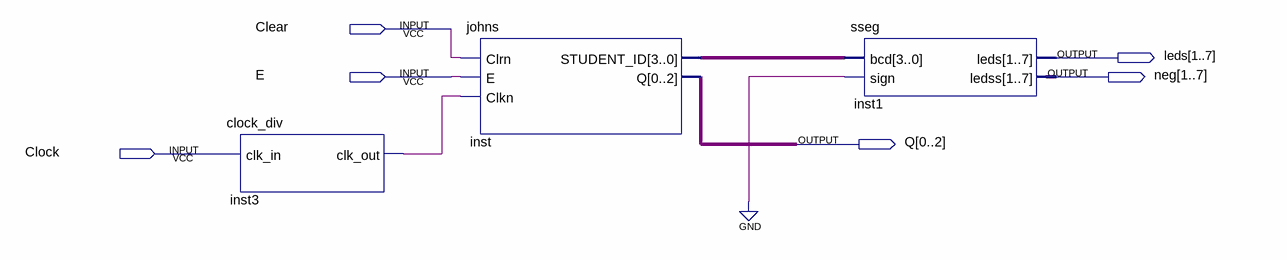
[diagram p0: schematic sheet]
// Quartus schematic JohnsBlock.bdf as structural Verilog: 3 symbols, 6 pins
module JohnsBlock (
  input  Clear,
  input  E,
  input  Clock,
  output [1:7] leds,
  output [1:7] neg,
  output [0:2] Q
);

  wire inst3_clk_out;
  wire [3:0] inst_student_id;

  clock_div inst3 (.clk_in(Clock), .clk_out(inst3_clk_out));
  johns inst (.Clrn(Clear), .E(E), .Clkn(inst3_clk_out), .STUDENT_ID(inst_student_id), .Q(Q));
  sseg inst1 (.bcd(inst_student_id), .sign(1'b0), .leds(leds), .ledss(neg));
endmodule
